# Altium schematic sheet MicDSP.SchDoc
size A4 portrait
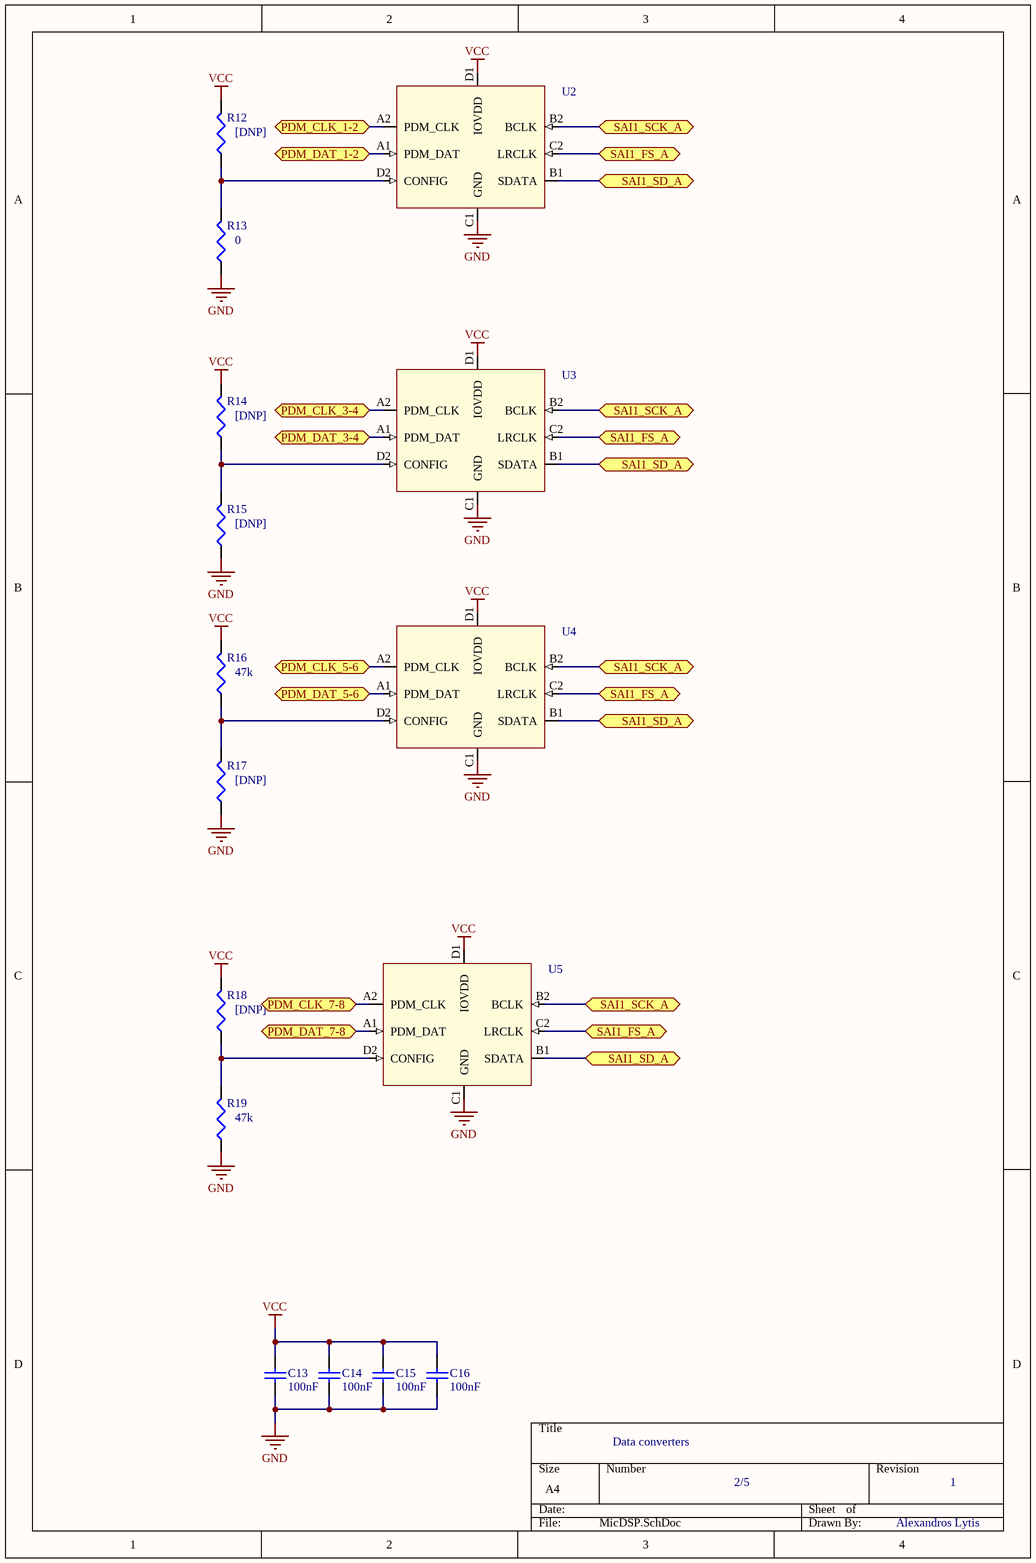
[diagram p0: MicDSP.SchDoc]

## Parts
C13  value 100nF  [CAP0603]  (hidden comment: Cap Semi)
C14  value 100nF  [CAP0603]  (hidden comment: Cap Semi)
C15  value 100nF  [CAP0603]  (hidden comment: Cap Semi)
C16  value 100nF  [CAP0603]  (hidden comment: Cap Semi)
R12  value [DNP]  [RES0603]  (hidden comment: Res3)
R13  value 0  [RES0603]  (hidden comment: Res3)
R14  value [DNP]  [RES0603]  (hidden comment: Res3)
R15  value [DNP]  [RES0603]  (hidden comment: Res3)
R16  value 47k  [RES0603]  (hidden comment: Res3)
R17  value [DNP]  [RES0603]  (hidden comment: Res3)
R18  value [DNP]  [RES0603]  (hidden comment: Res3)
R19  value 47k  [RES0603]  (hidden comment: Res3)
U2  ADAU7002  [ADAU7002_]  (value not drawn)
U3  ADAU7002  [ADAU7002_]  (value not drawn)
U4  ADAU7002  [ADAU7002_]  (value not drawn)
U5  ADAU7002  [ADAU7002_]  (value not drawn)

## Ports
PDM_CLK_1-2, PDM_CLK_3-4, PDM_CLK_5-6, PDM_CLK_7-8, PDM_DAT_1-2, PDM_DAT_3-4, PDM_DAT_5-6, PDM_DAT_7-8, SAI1_FS_A, SAI1_SCK_A, SAI1_SD_A

## Nets
GND: C13.1 C14.1 C15.1 C16.1 R13.1 R15.1 R17.1 R19.1 U2.C1(GND) U3.C1(GND) U4.C1(GND) U5.C1(GND)
VCC: C13.2 C14.2 C15.2 C16.2 R12.2 R14.2 R16.2 R18.2 U2.D1(IOVDD) U3.D1(IOVDD) U4.D1(IOVDD) U5.D1(IOVDD)
PDM_CLK_1-2: U2.A2(PDM_CLK) ; port PDM_CLK_1-2
PDM_CLK_3-4: U3.A2(PDM_CLK) ; port PDM_CLK_3-4
PDM_CLK_5-6: U4.A2(PDM_CLK) ; port PDM_CLK_5-6
PDM_CLK_7-8: U5.A2(PDM_CLK) ; port PDM_CLK_7-8
PDM_DAT_1-2: U2.A1(PDM_DAT) ; port PDM_DAT_1-2
PDM_DAT_3-4: U3.A1(PDM_DAT) ; port PDM_DAT_3-4
PDM_DAT_5-6: U4.A1(PDM_DAT) ; port PDM_DAT_5-6
PDM_DAT_7-8: U5.A1(PDM_DAT) ; port PDM_DAT_7-8
SAI1_FS_A: U2.C2(LRCLK) U3.C2(LRCLK) U4.C2(LRCLK) U5.C2(LRCLK) ; port SAI1_FS_A
SAI1_SCK_A: U2.B2(BCLK) U3.B2(BCLK) U4.B2(BCLK) U5.B2(BCLK) ; port SAI1_SCK_A
SAI1_SD_A: U2.B1(SDATA) U3.B1(SDATA) U4.B1(SDATA) U5.B1(SDATA) ; port SAI1_SD_A
NetR12_1: R12.1 R13.2 U2.D2(CONFIG)
NetR14_1: R14.1 R15.2 U3.D2(CONFIG)
NetR16_1: R16.1 R17.2 U4.D2(CONFIG)
NetR18_1: R18.1 R19.2 U5.D2(CONFIG)

## Notes on the sheet
- Data converters
- 2/5
- 1
- Alexandros Lytis

## Library data of the parts
C13-C16 = Cap Semi: Capacitor (Semiconductor SIM Model); Published: 8-Jun-2000; LatestRevisionDate: 29-May-2009; LatestRevisionNote: IPC-7351 Footprint Added.; PackageReference: C1206; Publisher: Altium Limited; PackageDescription: Chip Capacitor
R12-R19 = Res3: Resistor; Published: 8-Jun-2000; LatestRevisionDate: 29-May-2009; LatestRevisionNote: IPC-7351 Footprint Added.; PackageReference: J1-0603; Publisher: Altium Limited; PackageDescription: Chip Resistor